# EAGLE design ballon (EAGLE 9.6.2)
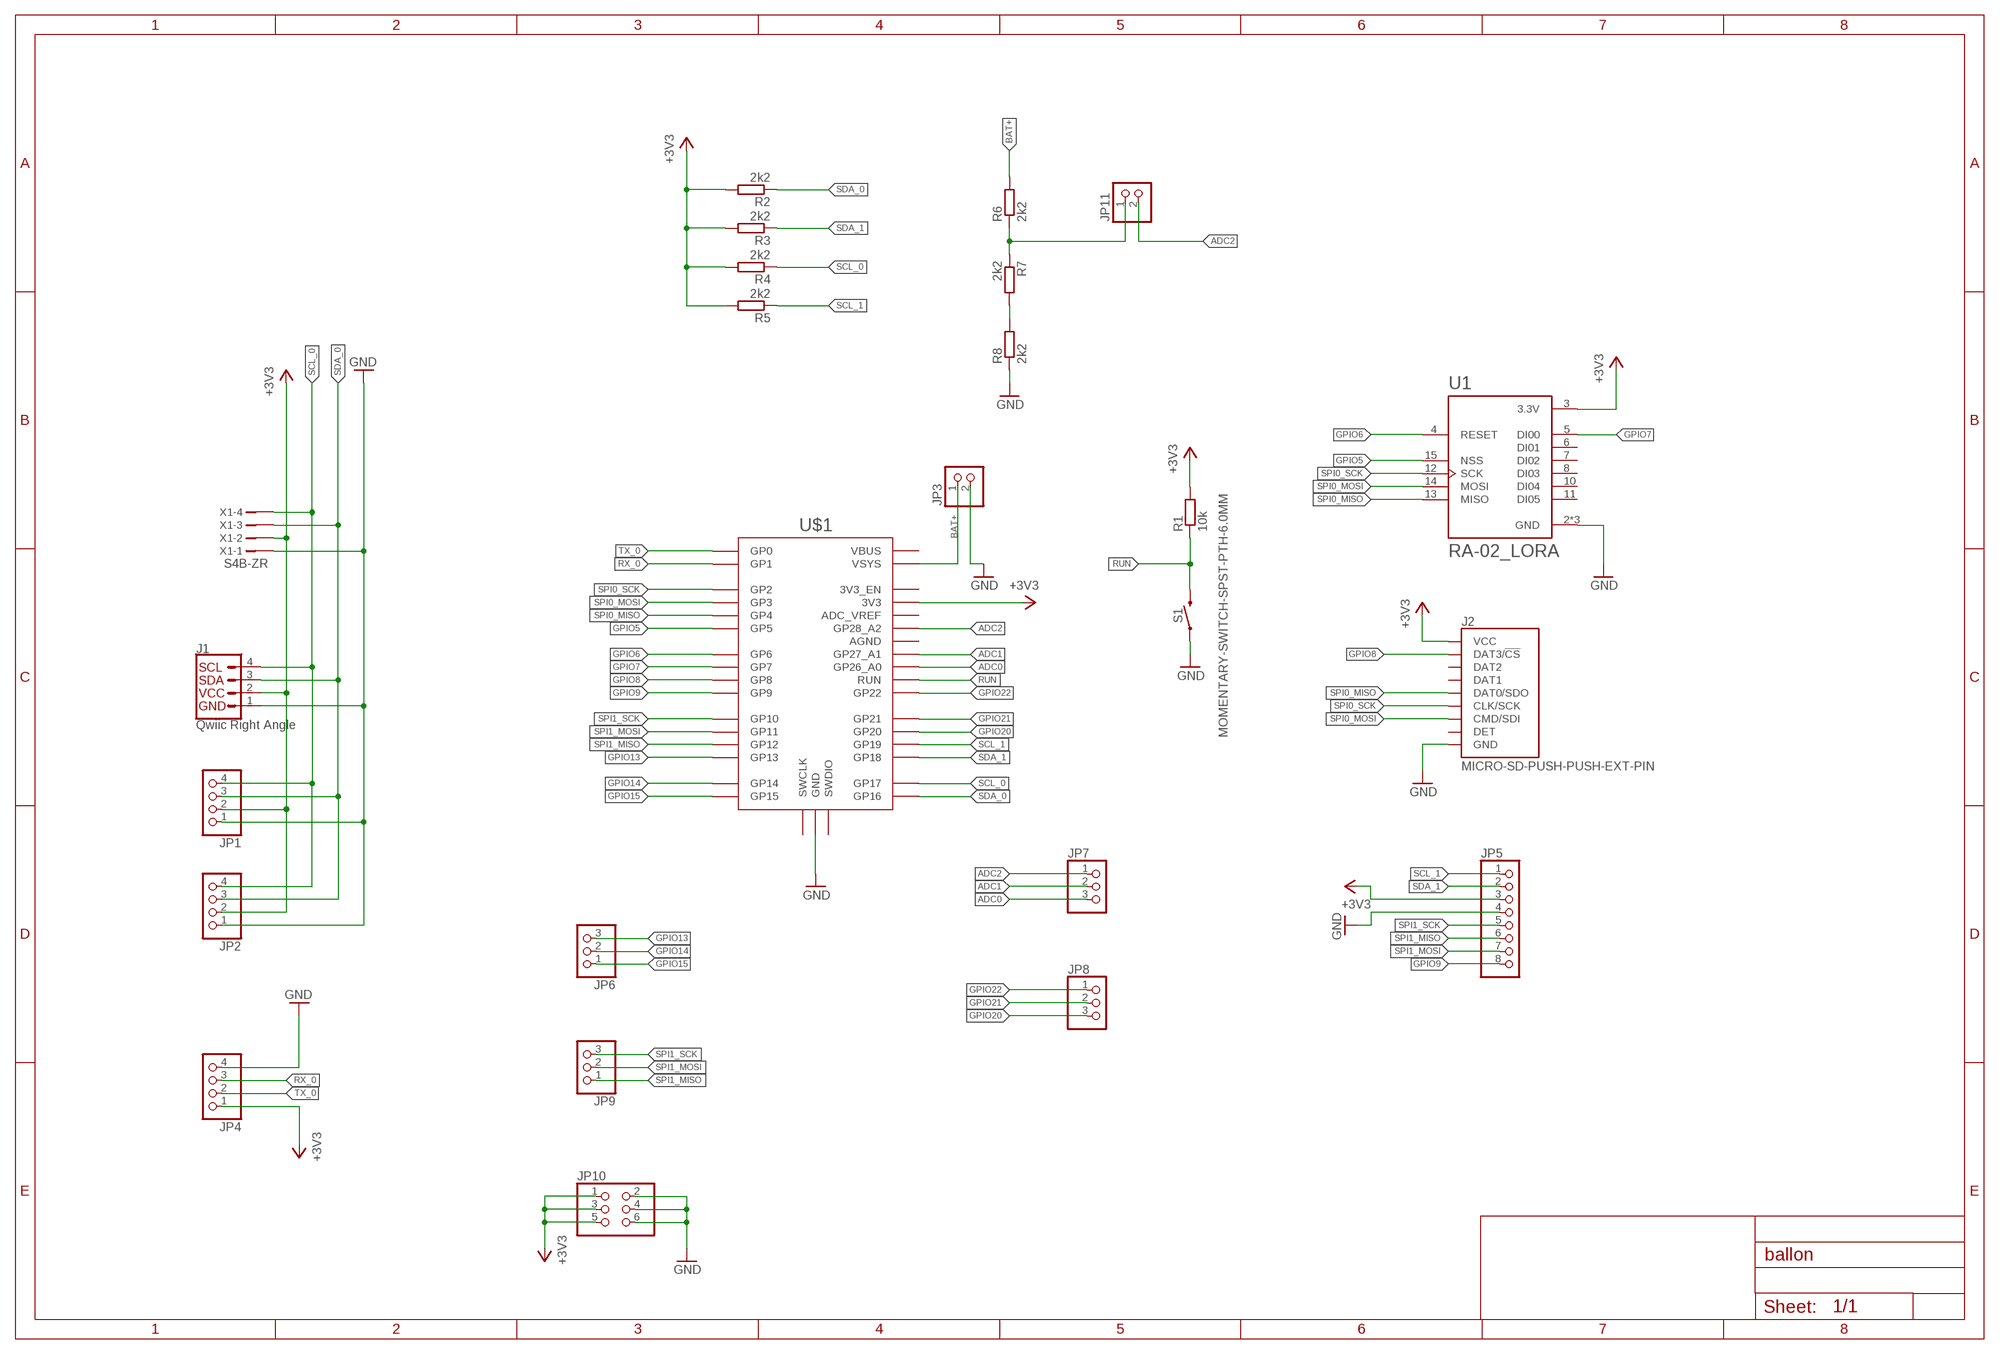
[diagram p0: schematic, sheet 1]

## Parts
J1  Qwiic Right Angle  I2C_STANDARDQWIIC  [JST04_1MM_RA]
J2  MICRO-SD-PUSH-PUSH-EXT-PIN  [MICROSD-EXTERNALPIN]
JP1  PINHD-1X4  [1X04]
JP2  PINHD-1X4  [1X04]
JP3  PINHD-1X2  [1X02]
JP4  PINHD-1X4  [1X04]
JP5  PINHD-1X8  [1X08]
JP6  PINHD-1X3  [1X03]
JP7  PINHD-1X3  [1X03]
JP8  PINHD-1X3  [1X03]
JP9  PINHD-1X3  [1X03]
JP10  PINHD-2X3  [2X03]
JP11  PINHD-1X2  [1X02]
R1  10k  R-EU_0204/7  [0204/7]
R2  2k2  R-EU_0204/7  [0204/7]
R3  2k2  R-EU_0204/7  [0204/7]
R4  2k2  R-EU_0204/7  [0204/7]
R5  2k2  R-EU_0204/7  [0204/7]
R6  2k2  R-EU_0204/7  [0204/7]
R7  2k2  R-EU_0204/7  [0204/7]
R8  2k2  R-EU_0204/7  [0204/7]
S1  MOMENTARY-SWITCH-SPST-PTH-6.0MM  [TACTILE_SWITCH_PTH_6.0MM]
U1  RA-02_LORA  [MODULE_RA-02_LORA]
U$1  RPI_PICO-SMD  [RPI_PICO]
X1  S4B-ZR  [S4B-ZR]

## Nets
+3V3: J1.2 J2.4(VCC) JP1.2 JP2.2 JP4.1 JP5.3 JP10.1 JP10.3 JP10.5 R1.2 R2.2 R3.2 R4.2 R5.2 U1.3(3.3V) U$1.3V3 X1.2
ADC0: JP7.3 U$1.GP26_A0
ADC1: JP7.2 U$1.GP27_A1
ADC2: JP7.1 JP11.2 U$1.GP28_A2
BAT+: JP3.1 R6.2 U$1.VSYS
GND: J1.1 J2.6(GND) J2.10(GND) J2.11(GND) J2.12(GND) J2.13(GND) JP1.1 JP2.1 JP3.2 JP4.4 JP5.4 JP10.2 JP10.4 JP10.6 R8.1 S1.1 U1.2(GND) U1.9(GND) U1.16(GND) U$1.GND@1(GND) U$1.GND@2(GND) U$1.GND@3(GND) U$1.GND@4(GND) U$1.GND@5(GND) U$1.GND@6(GND) U$1.GND@7(GND) U$1.GND@8(GND) X1.1
GPIO5: U1.15(NSS) U$1.GP5
GPIO6: U1.4(RESET) U$1.GP6
GPIO7: U1.5(DI00) U$1.GP7
GPIO8: J2.2(DAT3/!CS!) U$1.GP8
GPIO9: JP5.8 U$1.GP9
GPIO13: JP6.3 U$1.GP13
GPIO14: JP6.2 U$1.GP14
GPIO15: JP6.1 U$1.GP15
GPIO20: JP8.3 U$1.GP20
GPIO21: JP8.2 U$1.GP21
GPIO22: JP8.1 U$1.GP22
N$1: R7.2 R8.2
N$3: JP11.1 R6.1 R7.1
RUN: R1.1 S1.3 U$1.RUN
RX_0: JP4.3 U$1.GP1
SCL_0: J1.4 JP1.4 JP2.4 R4.1 U$1.GP17 X1.4
SCL_1: JP5.1 R5.1 U$1.GP19
SDA_0: J1.3 JP1.3 JP2.3 R2.1 U$1.GP16 X1.3
SDA_1: JP5.2 R3.1 U$1.GP18
SPI0_MISO: J2.7(DAT0/SDO) U1.13(MISO) U$1.GP4
SPI0_MOSI: J2.3(CMD/SDI) U1.14(MOSI) U$1.GP3
SPI0_SCK: J2.5(CLK/SCK) U1.12(SCK) U$1.GP2
SPI1_MISO: JP5.6 JP9.1 U$1.GP12
SPI1_MOSI: JP5.7 JP9.2 U$1.GP11
SPI1_SCK: JP5.5 JP9.3 U$1.GP10
TX_0: JP4.2 U$1.GP0
Unconnected: J2.1(DAT2) J2.8(DAT1) J2.9(DET) U1.6(DI01) U1.7(DI02) U1.8(DI03) U1.10(DI04) U1.11(DI05) U$1.3V3_EN U$1.ADC_VREF U$1.AGND U$1.SWCLK U$1.SWDIO U$1.VBUS

## Library data of the parts
J1 = SparkFun-Connectors:I2C_STANDARD: SparkFun I2C Standard Pinout Header SparkFun has standardized on a pinout for all I2C based sensor breakouts. This pinout allows I2C boards to be plugged directly into the headers on Arduino Uno compatible boards, and to be daisy chained easily. Example SparkFun Products: SparkFun Atmospheric Sensor Breakout - BME280 <https://www.sparkfun.com/products/13676> SparkFun Altitude/Pressure Sensor Breakout - MPL3115A2 <https://www.sparkfun.com/products/11084> SparkFun TOF Range Finder Sensor - VL6180 <https://www.sparkfun.com/products/12785>; PROD_ID: CONN-13694
J2 = SparkFun-Connectors:MICRO-SD: microSD Socket for Transflash Various sockets for µSD. tDoc lines correctly indicate media card edge positions when inserting (unlocked, locked, depressed). NOTE: CD1 and CD2 are connected internally, and the default detect state of the socket is detect pin to ground. SparkFun Products: WAV Trigger <https://www.sparkfun.com/products/13660> CAN-Bus Shield <https://www.sparkfun.com/products/13262> SparkFun Level Shifing microSD Breakout <https://www.sparkfun.com/products/13743>; PROD_ID: CONN-16110
JP1 JP2 JP4 = pinhead:PINHD-1X4: PIN HEADER
JP3 JP11 = pinhead:PINHD-1X2: PIN HEADER
JP5 = pinhead:PINHD-1X8: PIN HEADER
JP6-JP9 = pinhead:PINHD-1X3: PIN HEADER
JP10 = pinhead:PINHD-2X3: PIN HEADER
R1-R8 = rcl:R-EU_: RESISTOR, European symbol; SPICEPREFIX: R
S1 = SparkFun-Switches:MOMENTARY-SWITCH-SPST: Momentary Switch (Pushbutton) - SPST Normally-open (NO) SPST momentary switches (buttons, pushbuttons). Variants PTH-12MM - 12mm square, through-hole Momentary Pushbutton Switch - 12mm Square <https://www.sparkfun.com/products/9190> (COM-09190) PTH-6.0MM, PTH-6.0MM-KIT - 6.0mm square, through-hole Mini Pushbutton Switch <https://www.sparkfun.com/products/97> (COM-00097) KIT package intended for soldering kit's - only one side of pads' copper is exposed. PTH-RIGHT-ANGLE-KIT - Right-angle, through-hole Right Angle Tactile Button <https://www.sparkfun.com/products/10791> - Used on SparkFun BigTime Watch Kit <https://www.sparkfun.com/products/11734> SMD-12MM - 12mm square, surface-mount Tactile Button - SMD (12mm) <https://www.sparkfun.com/products/12993> (COM-12993) Used on SparkFun PicoBoard <https://www.sparkfun.com/products/11888> SMD-4.5MM - 4.5mm Square Trackball Switch Used on SparkFun Blackberry Trackballer Breakout <https://www.sparkfun.com/products/13169> SMD-4.6MMX2.8MM - 4.60mm x 2.80mm, surface mount Used on SparkFun Pro Micro - RP2040 <https://www.sparkfun.com/products/17717> SMD-5.2MM, SMD-5.2-REDUNDANT - 5.2mm square, surface-mount Mini Pushbutton Switch - SMD <https://www.sparkfun.com/products/8720> (COM-08720) Used on Arduino Pro Mini <https://www.sparkfun.com/products/11114> REDUNDANT package connects both switch circuits together SMD-6.0X3.5MM - 6.0 x 3.5mm, surface mount Momentary Reset Switch SMD <https://www.sparkfun.com/products/8229> (COM-08229) SMD-6.2MM-TALL - 6.2mm square, surface mount Tactile Button - SMD (6mm) <https://www.sparkfun.com/products/12992> Used on SparkFun Digital Sandbox <https://www.sparkfun.com/products/12651> SMD-RIGHT-ANGLE - Right-angle, surface mount Used on SparkFun Block for Intel® Edison - Arduino <https://www.sparkfun.com/products/13036>; PROD_ID: SWCH-08441; SF_SKU: COM-00097
U1 = RA-02_LORA:RA-02_LORA: Ra-02 LoRa RF M5Stack Platform Evaluation Expansion Board Check prices <https://pricing.snapeda.com/parts/Ra-02%20LoRa/AI-Thinker/view-part?ref=eda>; AVAILABILITY: Not in stock; DESCRIPTION: Ra-02 LoRa RF M5Stack Platform Evaluation Expansion Board; MF: AI-Thinker; MP: Ra-02 LoRa; PACKAGE: None; PRICE: None
U$1 = RaspberryPi_Pico:RPI_PICO
X1 = con-jst:?4B-ZR: ZH CONNECTOR 1.5 mm, 4 pin 1 row Source: http://www.jst.com .. eZH.pdf; MF: FARNELL; MPN: S4B-ZR(LF)(SN); OC_FARNELL: 9491830; OC_NEWARK: 38K8076

## Net classes
0 default: width 0.635 mm

## Board
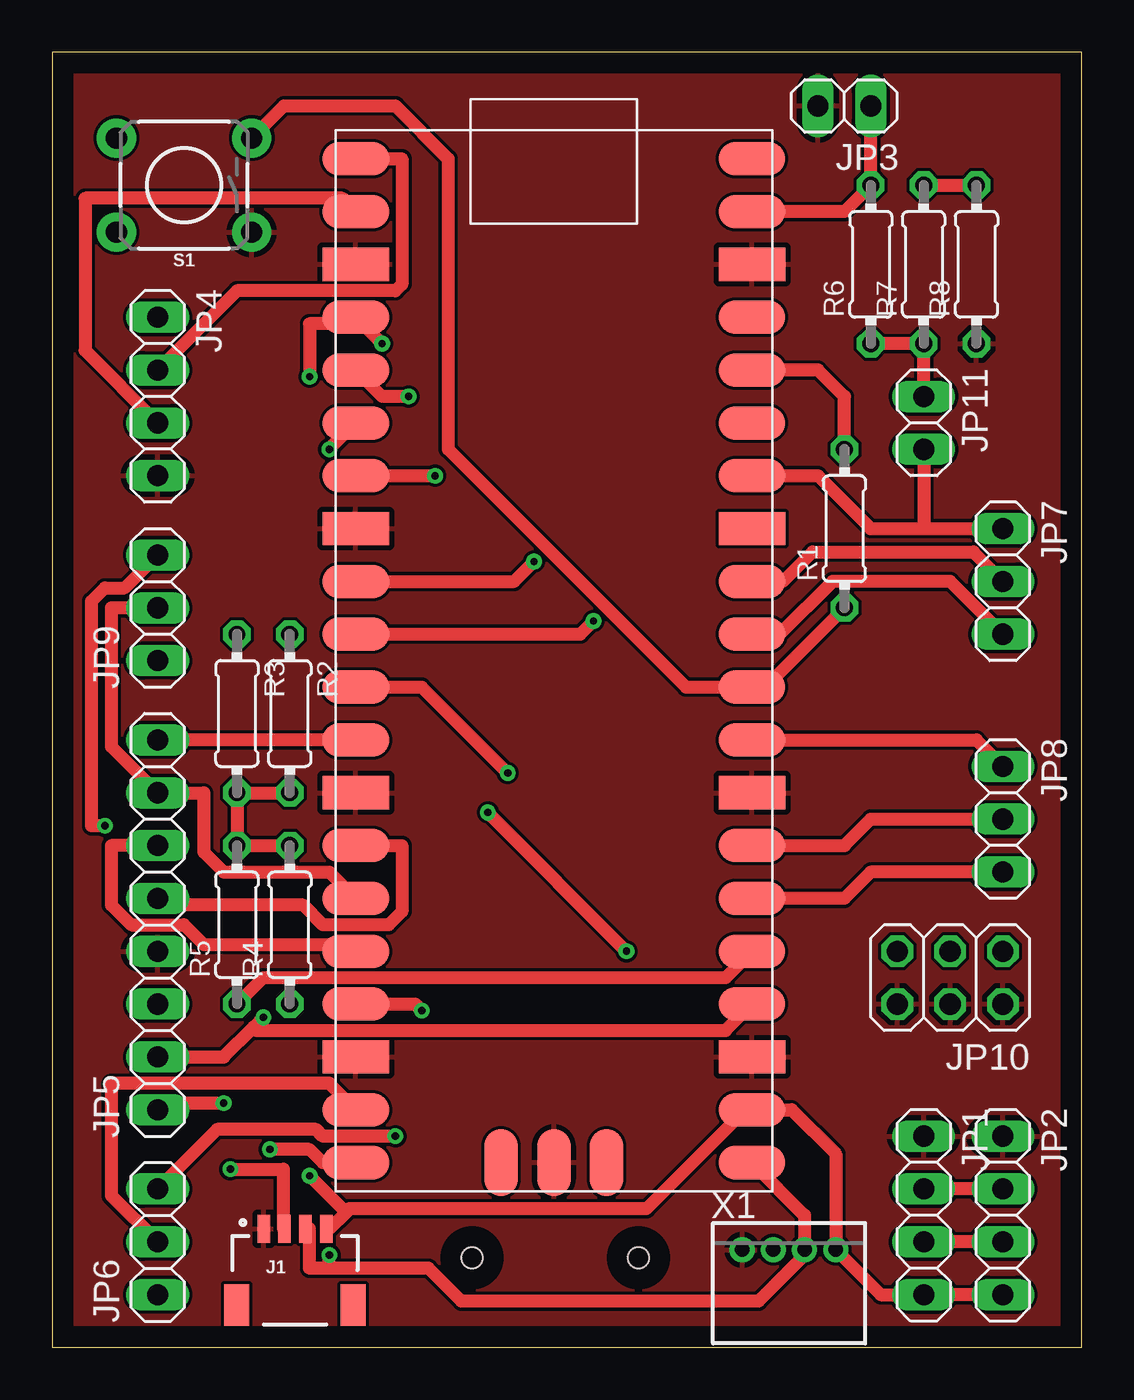
[diagram p1: board, top side]
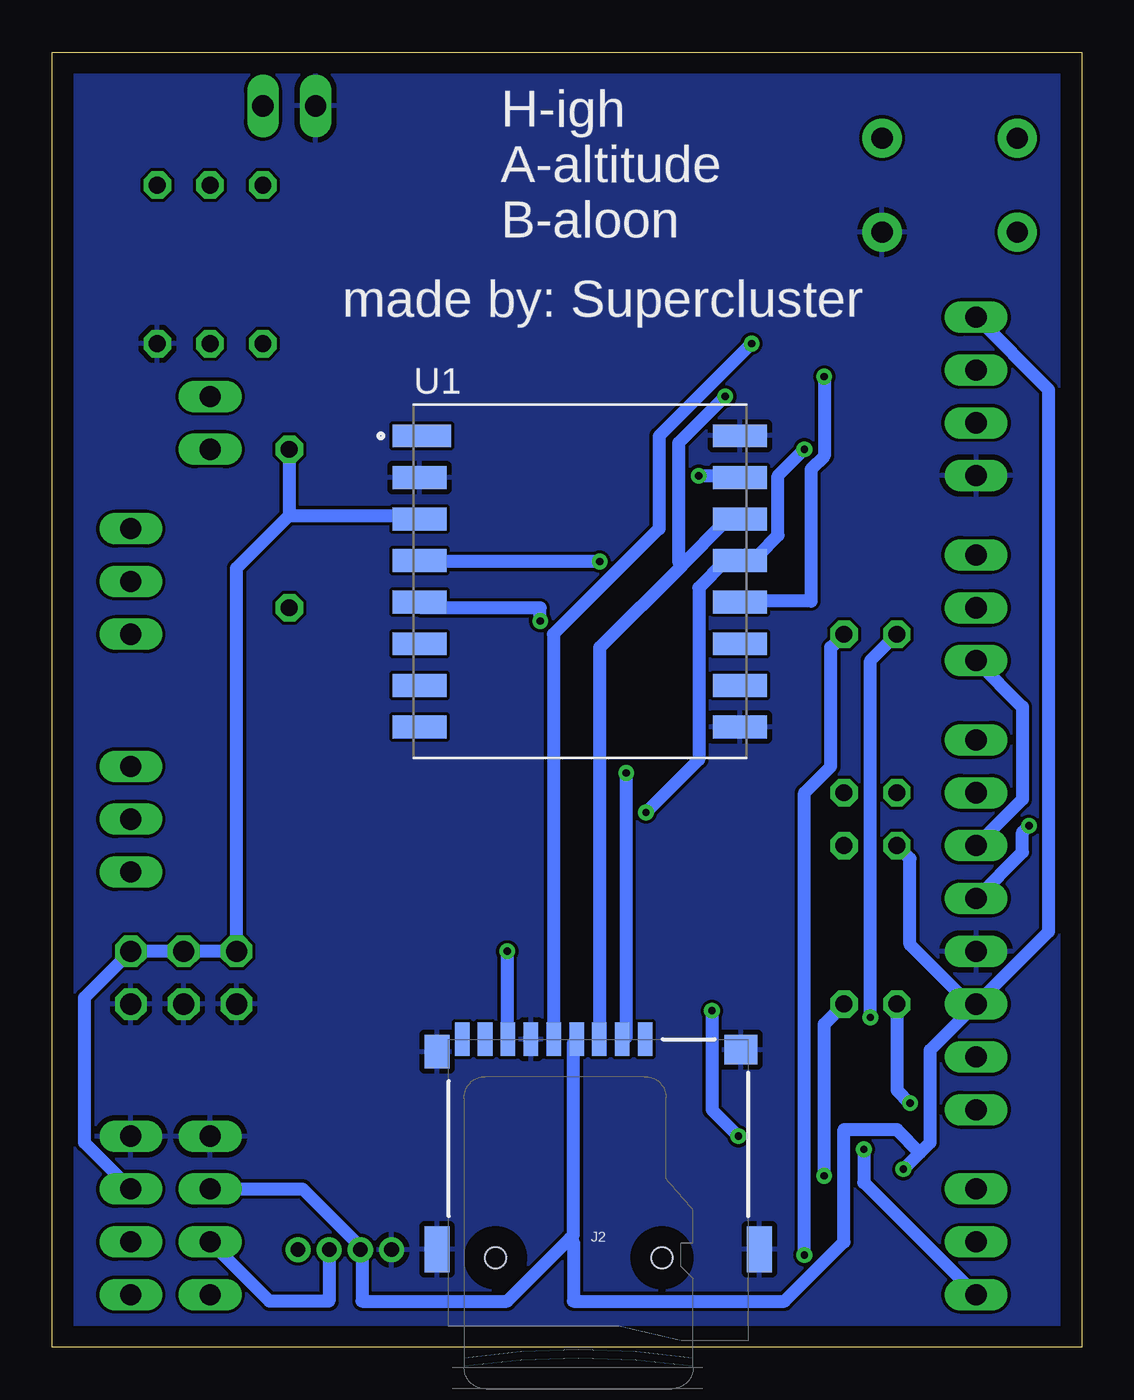
[diagram p2: board, bottom side, seen from below]

Size 49.51 x 62.28 mm. Coordinates in mm from the lower left corner, seen from the top.
Outline: 0,0 49.51,0 49.51,62.28 0,62.28 0,0
Copper layers (1*16): Top 0.035mm / dielectric 1.5mm / Bottom 0.035mm
Design rules "default": minimum track width 6mil, minimum drill 0.35mm, track to track 6mil, track to pad 6mil, pad to pad 6mil, via to via 6mil, smd to smd 6mil, copper to edge 40mil, drill to drill 6mil, minimum pad ring 10mil, minimum via ring 8mil, stop-mask expansion 4mil, vias tented up to drill 0mil, thermal gap 10mil

### Footprints (pad centres in the part's own frame; a part is rotated, then mirrored left to right if it is on the bottom)
JST04_1MM_RA = smd 0.6 x 1.35: 1 -1.5,0; 2 -0.5,0; 3 0.5,0; 4 1.5,0 | smd 1.2 x 2: NC1 2.8,-3.675; NC2 -2.8,-3.675
MICROSD-EXTERNALPIN = smd 0.7 x 1.6: 1 2.25,10.5; 2 1.15,10.5; 3 0.05,10.5; 4 -1.05,10.5; 5 -2.15,10.5; 6 -3.25,10.5; 7 -4.35,10.5; 8 -5.45,10.5; 9 -6.55,10.5 | smd 1.2 x 1.6: 10 -7.75,9.9 | smd 1.2 x 2.2: 11 -7.75,0.4; 12 7.75,0.4 | smd 1.6 x 1.4: 13 6.85,10 | hole 1: 3.05,0; -4.95,0
1X04 = drill 1.016 long: 1 -3.81,0; 2 -1.27,0; 3 1.27,0; 4 3.81,0
1X02 = drill 1.016 long: 1 -1.27,0; 2 1.27,0
1X08 = drill 1.016 long: 1 -8.89,0; 2 -6.35,0; 3 -3.81,0; 4 -1.27,0; 5 1.27,0; 6 3.81,0; 7 6.35,0; 8 8.89,0
1X03 = drill 1.016 long: 1 -2.54,0; 2 0,0; 3 2.54,0
2X03 = drill 1.016 octagon: 1 -2.54,-1.27; 2 -2.54,1.27; 3 0,-1.27; 4 0,1.27; 5 2.54,-1.27; 6 2.54,1.27
0204/7 = drill 0.813 octagon: 1 -3.81,0; 2 3.81,0
TACTILE_SWITCH_PTH_6.0MM = drill 1.016 pad 1.88: 1 -3.251,2.261; 2 3.251,2.261; 3 -3.251,-2.261; 4 3.251,-2.261
MODULE_RA-02_LORA = smd 2.8 x 1.1: 1 -7.6,7 | smd 2.6 x 1.1: 2 -7.7,5; 3 -7.7,3; 4 -7.7,1; 5 -7.7,-1; 6 -7.7,-3; 7 -7.7,-5; 8 -7.7,-7; 9 7.7,-7; 10 7.7,-5; 11 7.7,-3; 12 7.7,-1; 13 7.7,1; 14 7.7,3; 15 7.7,5; 16 7.7,7
RPI_PICO = smd 3.2 x 1.6: 3V3 9.525,13.97; 3V3_EN 9.525,16.51; ADC_VREF 9.525,11.43; AGND 9.525,6.35; GND@1 -9.525,19.05; GND@2 -9.525,6.35; GND@3 -9.525,-6.35; GND@4 -9.525,-19.05; GND@6 9.525,-19.05; GND@7 9.525,-6.35; GND@8 9.525,19.05; GP0 -9.525,24.13; GP1 -9.525,21.59; GP2 -9.525,16.51; GP3 -9.525,13.97; GP4 -9.525,11.43; GP5 -9.525,8.89; GP6 -9.525,3.81; GP7 -9.525,1.27; GP8 -9.525,-1.27; GP9 -9.525,-3.81; GP10 -9.525,-8.89; GP11 -9.525,-11.43; GP12 -9.525,-13.97; GP13 -9.525,-16.51; GP14 -9.525,-21.59; GP15 -9.525,-24.13; GP16 9.525,-24.13; GP17 9.525,-21.59; GP18 9.525,-16.51; GP19 9.525,-13.97; GP20 9.525,-11.43; GP21 9.525,-8.89; GP22 9.525,-3.81; GP26_A0 9.525,1.27; GP27_A1 9.525,3.81; GP28_A2 9.525,8.89; RUN 9.525,-1.27; VBUS 9.525,24.13; VSYS 9.525,21.59 | smd 1.6 x 3.2: GND@5 0,-24.13; SWCLK -2.54,-24.13; SWDIO 2.54,-24.13
S4B-ZR = drill 0.7 pad 1.1: 1 -2.25,0; 2 -0.75,0; 3 0.75,0; 4 2.25,0

### Placement (x,y rotation side)
J1  11.68,5.71 0 top
J2  23.24,4.32 0 bottom
JP1  41.91,6.35 270 top
JP2  45.72,6.35 270 top
JP3  38.1,59.69 180 top
JP4  5.08,45.72 270 top
JP5  5.08,20.32 90 top
JP6  5.08,5.08 90 top
JP7  45.72,36.83 270 top
JP8  45.72,25.4 270 top
JP9  5.08,35.56 90 top
JP10  43.18,17.78 180 top
JP11  41.91,44.45 270 top
R1  38.1,39.37 90 top
R2  11.43,30.48 270 top
R3  8.89,30.48 270 top
R4  11.43,20.32 90 top
R5  8.89,20.32 90 top
R6  39.37,52.07 90 top
R7  41.91,52.07 90 top
R8  44.45,52.07 90 top
S1  6.35,55.88 180 top
U1  24.13,36.83 0 bottom
U$1  24.13,33.02 0 top
X1  35.43,4.7 0 top

### Tracks (layer width: path | path; a pad name or v marks a point on that pad's centre or on a via)
+3V3  (via drill 0.35)
  Top 0.635: R1.2 38.1,45.72 36.83,46.99 U$1.3V3 | JP2.2 JP1.2 | R4.2 R5.2 R3.2 R2.2 | v8.57,8.57 11.11,8.57 11.11,5.71 J1.2
  Bottom 0.635: 7.78,9.37 7.3,9.84 7.3,14.29 JP5.3 | 7.78,9.37 v8.57,8.57 | JP4.1 1.59,46.04 1.59,20 JP5.3 | R5.2 8.26,23.5 8.26,19.37 5.4,16.51 JP5.3 | 24.61,5.24 27.62,2.22 34.61,2.22 34.61,4.45 X1.2 34.92,4.76 34.92,5.08 37.47,7.62 JP1.2 | 24.61,5.24 24.45,5.4 24.45,14.61 J2.4 | 38.1,40.01 32.07,40.01 U1.3 | R1.2 38.1,40.01 | JP2.2 47.94,9.84 47.94,16.83 JP10.1 JP10.3 JP10.5 40.64,37.47 38.1,40.01 | 7.78,9.37 8.89,10.48 11.43,10.48 11.43,5.08 14.29,2.22 24.45,2.22 24.45,5.08 24.61,5.24
ADC0
  Top 0.635: JP7.3 43.18,36.83 37.52,36.83 34.98,34.29 U$1.GP26_A0 | U$1.GP26_A0
ADC1
  Top 0.635: U$1.GP27_A1 35.14,36.83 36.56,38.25 44.3,38.25 JP7.2
ADC2
  Top 0.635: U$1.GP28_A2 36.83,41.91 39.37,39.37 41.91,39.37 | 44.45,39.37 JP7.1 41.91,39.37 | JP11.2 41.91,39.37
BAT+
  Top 0.635: U$1.VSYS 38.1,54.61 R6.2 JP3.1
GND
  pour Top: 0,0 0,62.23 49.53,62.23 49.53,0
  pour Bottom: 0,0 0,62.23 49.53,62.23 49.53,0
GPIO5  (via drill 0.35)
  Top 0.635: U$1.GP5 v18.41,41.91
  Bottom 0.635: v18.41,41.91 16.51,41.91 U1.15
GPIO6  (via drill 0.35)
  Top 0.635: v23.18,37.78 22.23,36.83 U$1.GP6
  Bottom 0.635: v23.18,37.78 31.75,37.78 U1.4
GPIO7  (via drill 0.35)
  Top 0.635: v26.04,34.92 25.4,34.29 U$1.GP7
  Bottom 0.635: v26.04,34.92 26.04,35.56 31.75,35.56 U1.5
GPIO8  (via drill 0.35)
  Top 0.635: v21.91,27.62 17.78,31.75 U$1.GP8
  Bottom 0.635: v21.91,27.62 21.91,14.92 J2.2
GPIO9
  Top 0.635: U$1.GP9 JP5.8
GPIO13  (via drill 0.35)
  Top 0.635: JP6.3 7.94,10.48 12.7,10.48 13.02,10.16 v16.51,10.16 | v17.78,16.19 17.46,16.51 U$1.GP13
  Bottom 0.635: v16.51,10.16 17.78,11.43 v17.78,16.19
GPIO14
  Top 0.635: JP6.2 2.86,7.3 2.86,12.7 13.34,12.7 U$1.GP14
GPIO15  (via drill 0.35)
  Top 0.635: v10.48,9.53 12.38,9.53 13.02,8.89 U$1.GP15
  Bottom 0.635: JP6.1 10.48,7.94 v10.48,9.53
GPIO20
  Top 0.635: U$1.GP20 38.1,21.59 39.37,22.86 JP8.3
GPIO21
  Top 0.635: U$1.GP21 38.1,24.13 39.37,25.4 JP8.2
GPIO22
  Top 0.635: U$1.GP22 44.45,29.21 JP8.1
N$1
  Top 0.635: R7.2 R8.2
N$3
  Top 0.635: R6.1 R7.1 JP11.1
RUN
  Top 0.635: R1.1 34.29,31.75 U$1.RUN 30.48,31.75 19.05,43.18 19.05,57.15 16.51,59.69 11.15,59.69 S1.3
RX_0
  Top 0.635: JP4.3 1.59,47.94 1.59,55.24 13.97,55.24 U$1.GP1
SCL_0  (via drill 0.35)
  Top 0.635: JP2.4 JP1.4 39.84,2.54 X1.4 37.68,9.31 35.56,11.43 U$1.GP17 33.34,11.43 28.57,6.67 14.29,6.67 14.13,6.51 | 14.13,6.51 13.34,5.71 J1.4 | 14.13,6.51 v12.38,8.26
  Bottom 0.635: R4.1 12.38,15.56 v12.38,8.26
SCL_1  (via drill 0.35)
  Top 0.635: R5.1 10.16,17.78 32.38,17.78 U$1.GP19 | JP5.1 5.4,11.75 v8.26,11.75
  Bottom 0.635: v8.26,11.75 8.89,12.38 R5.1
SDA_0  (via drill 0.35)
  Top 0.635: U$1.GP16 36.18,6.36 X1.3 36.2,4.45 33.97,2.22 19.68,2.22 18.1,3.81 13.34,3.81 | JP2.3 JP1.3 | 13.34,3.81 12.38,3.81 12.38,5.71 J1.3 | 13.34,3.81 v13.34,4.45
  Bottom 0.635: R2.1 12.06,33.66 12.06,27.94 13.34,26.67 v13.34,4.45 | JP1.3 39.05,2.22 36.2,2.22 36.2,4.45 X1.3
SDA_1  (via drill 0.35)
  Top 0.635: 9.68,15.4 8.26,13.97 JP5.2 | 9.68,15.4 v10.16,15.88 | U$1.GP18 32.38,15.24 9.84,15.24 9.68,15.4
  Bottom 0.635: R3.1 10.16,33.02 v10.16,15.88
SPI0_MISO  (via drill 0.35)
  Top 0.635: v20.95,25.72 v27.62,19.05 | v13.34,43.18 U$1.GP4
  Bottom 0.635: v27.62,19.05 27.62,14.92 J2.7 | v20.95,25.72 18.41,28.26 18.41,36.51 17.14,37.78 16.51,37.78 U1.13 16.19,38.1 15.56,38.1 14.61,39.05 14.61,41.91 v13.34,43.18
SPI0_MOSI  (via drill 0.35)
  Top 0.635: U$1.GP3 15.88,45.72 v17.14,45.72
  Bottom 0.635: 19.21,37.62 17.14,39.69 16.51,39.69 U1.14 | 19.21,37.62 23.18,33.66 23.18,14.92 J2.3 | v17.14,45.72 19.37,43.5 19.37,37.78 19.21,37.62
SPI0_SCK  (via drill 0.35)
  Top 0.635: v15.88,48.26 U$1.GP2 14.61,49.21 12.38,49.21 v12.38,46.67
  Bottom 0.635: v15.88,48.26 20.32,43.81 20.32,39.37 25.4,34.29 25.4,14.92 J2.5 | v12.38,46.67 12.38,42.86 13.02,42.23 13.02,35.88 16.19,35.88 U1.12
SPI1_MISO
  Top 0.635: U$1.GP12 14.29,19.37 7.3,19.37 6.35,20.32 3.81,20.32 2.86,21.27 2.86,24.13 JP5.6
  Bottom 0.635: JP5.6 2.86,26.35 2.86,30.8 JP9.1
SPI1_MOSI
  Top 0.635: JP9.2 2.86,35.56 2.86,28.89 JP5.7 7.3,26.67 7.3,23.81 8.26,22.86 13.34,22.86 U$1.GP11
SPI1_SCK  (via drill 0.35)
  Top 0.635: JP5.5 5.4,21.27 12.06,21.27 13.02,20.32 16.19,20.32 16.83,20.95 16.83,24.13 U$1.GP10 | JP9.3 3.49,36.51 2.54,36.51 1.91,35.88 1.91,25.08 v2.54,25.08
  Bottom 0.635: v2.54,25.08 2.86,24.77 2.86,23.81 JP5.5
TX_0
  Top 0.635: JP4.2 8.89,50.8 16.51,50.8 16.83,51.12 16.83,57.15 U$1.GP0

### Text on the board
bNames: H-igh / A-altitude / B-aloon | made by: Supercluster